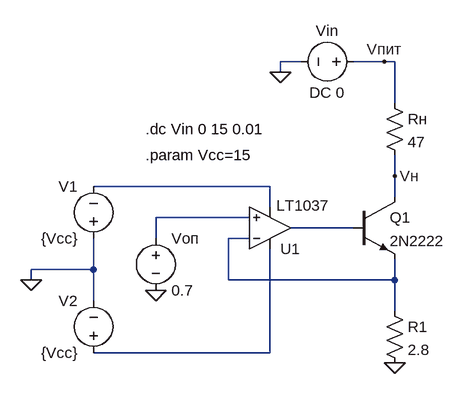
[diagram p0: schematic scheme3.asc]
scheme3.asc, the LTspice schematic file:
Version 4.1
SHEET 1 880 680
WIRE 208 -48 176 -48
WIRE 336 -48 288 -48
WIRE 352 -48 336 -48
WIRE 176 -32 176 -48
WIRE 352 16 352 -48
WIRE 352 128 352 96
WIRE 160 144 -112 144
WIRE 352 160 352 128
WIRE 160 176 160 144
WIRE 128 192 -16 192
WIRE 288 208 192 208
WIRE -16 224 -16 192
WIRE 128 224 96 224
WIRE -112 272 -112 224
WIRE -112 272 -208 272
WIRE -208 288 -208 272
WIRE 96 288 96 224
WIRE 352 288 352 256
WIRE 352 288 96 288
WIRE -112 320 -112 272
WIRE 352 336 352 288
WIRE 160 400 160 240
WIRE 160 400 -112 400
FLAG 176 -32 0
FLAG 352 416 0
FLAG 352 128 Vн
FLAG 336 -48 Vпит
FLAG -16 304 0
FLAG -208 288 0
SYMBOL OpAmps\\LT1037 160 272 M180
WINDOW 3 10 99 Left 2
SYMATTR InstName U1
SYMBOL npn 288 160 R0
SYMATTR InstName Q1
SYMATTR Value 2N2222
SYMBOL res 336 0 R0
SYMATTR InstName Rн
SYMATTR Value 47
SYMBOL voltage 304 -48 R90
WINDOW 0 -32 56 VBottom 2
WINDOW 3 32 56 VTop 2
SYMATTR InstName Vin
SYMATTR Value DC 0
SYMBOL res 336 320 R0
SYMATTR InstName R1
SYMATTR Value 2.8
SYMBOL voltage -16 208 R0
SYMATTR InstName Vоп
SYMATTR Value 0.7
SYMBOL voltage -112 240 R180
WINDOW 0 24 96 Left 2
WINDOW 3 24 16 Left 2
SYMATTR InstName V1
SYMATTR Value {Vcc}
SYMBOL voltage -112 416 R180
WINDOW 0 24 96 Left 2
WINDOW 3 24 16 Left 2
SYMATTR InstName V2
SYMATTR Value {Vcc}
TEXT -32 56 Left 2 !.dc Vin 0 15 0.01
TEXT -32 96 Left 2 !.param Vcc=15

The netlist it stands for:
* scheme3.asc
X§U1 N002 N004 N005 N001 N003 LT1037  ; pins In+ In- V+ V- OUT
Q1 Vн N003 N004 0 2N2222
Rн Vпит Vн 47
Vin Vпит 0 DC 0
R1 N004 0 2.8
Vоп N002 0 0.7
V1 0 N001 {Vcc}
V2 N005 0 {Vcc}
.model NPN NPN
.model PNP PNP
.lib standard.bjt
.dc Vin 0 15 0.01
.param Vcc=15
.backanno
.end